# Altium schematic sheet INA180_Breakout.SchDoc: Low Side Current Sense
size A4; Author: Chawthri K.; Organization: Waterloop; Address1: 200 University Ave W; Address2: Engineering 5, 1104; Address3: Waterloo, ON; Address4: N2L 3G1; Revision: 0; SheetNumber: 1; SheetTotal: 1
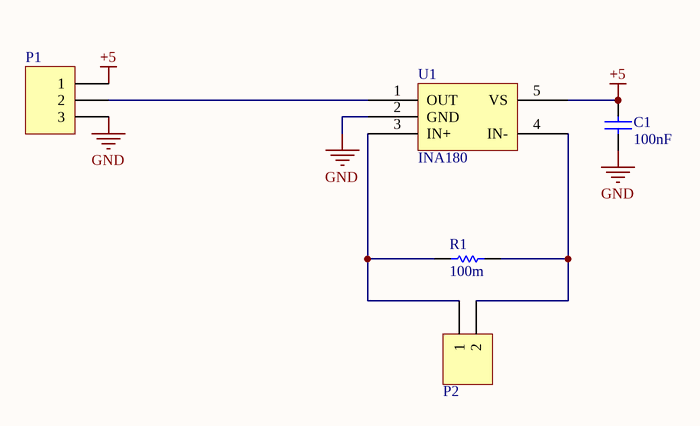
[diagram p0: INA180_Breakout.SchDoc]

## Parts
C1  value 100nF  [0805 - Capacitor]  (hidden comment: Capacitor - Nonpolarized)
P1  1x3 Header  [HDR1X3]  (value not drawn)
P2  1x2 Header  [HDR1X2]  (value not drawn)
R1  value 100m  [0805 - Resistor]  (hidden comment: Resistor)
U1  INA180  [INA180]

## Nets
+5: C1.2 P1.1 U1.5(VS)
GND: C1.1 P1.3 U1.2(GND)
NetP1_2: P1.2 U1.1(OUT)
NetP2_1: P2.1 R1.1 U1.3(IN+)
NetP2_2: P2.2 R1.2 U1.4(IN-)

## Notes on the sheet
- Title:
- Size:
- Date:
- A4
- Author:
- Revision:
- Sheet
- of
- File:

## Library data of the parts
C1 = Capacitor - Nonpolarized: Nonpolarized Capacitor; Manufacturer: Yageo; Manufacturer Part Number: CC0805KRX7R9BB104; Supplier Part Number: 311-1140-1-ND; Supplier: *; Rating: *
P1 = 1x3 Header: 1x3 Pin Header
P2 = 1x2 Header: 1x2 Pin Header
R1 = Resistor: Manufacturer Part Number: 73L3R10J; Manufacturer: CTS; Rating: *; Supplier Part Number: 73L3R10JCT-ND; Supplier: *
U1 = INA180: 0V to 26V Current Sense Amplifier; Manufacturer: Texas Instruments; Manufacturer Part Number: INA180A2IDBVR; Parameter 4: 296-47653-1-ND; Datasheet: https://www.ti.com/lit/ds/symlink/ina180.pdf